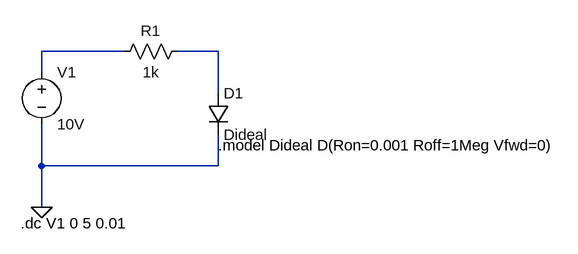
[diagram p0: schematic Ideal Diode DC Sweep.asc]
Ideal Diode DC Sweep.asc, the LTspice schematic file:
Version 4.1
SHEET 1 880 680
WIRE 128 80 0 80
WIRE 272 80 208 80
WIRE 0 112 0 80
WIRE 272 144 272 80
WIRE 0 256 0 192
WIRE 272 256 272 208
WIRE 272 256 0 256
WIRE 0 320 0 256
FLAG 0 320 0
SYMBOL res 224 64 R90
WINDOW 0 0 56 VBottom 2
WINDOW 3 32 56 VTop 2
SYMATTR InstName R1
SYMATTR Value 1k
SYMBOL diode 256 144 R0
SYMATTR InstName D1
SYMATTR Value Dideal
SYMBOL voltage 0 96 R0
SYMATTR InstName V1
SYMATTR Value 10V
TEXT 272 224 Left 2 !.model Dideal D(Ron=0.001 Roff=1Meg Vfwd=0)
TEXT -32 344 Left 2 !.dc V1 0 5 0.01

The netlist it stands for:
* Ideal Diode DC Sweep.asc
R1 N002 N001 1k
D1 N002 0 Dideal
V1 N001 0 10V
.model D D
.lib standard.dio
.model Dideal D(Ron=0.001 Roff=1Meg Vfwd=0)
.dc V1 0 5 0.01
.backanno
.end